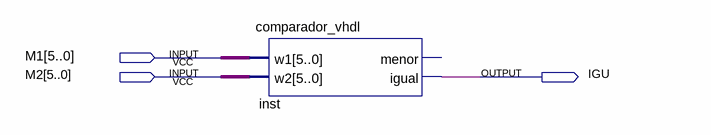
[diagram p0: schematic sheet]
// Quartus schematic PRUEBAS.bdf as structural Verilog: 1 symbols, 3 pins
module PRUEBAS (
  input  [5:0] M1,
  input  [5:0] M2,
  output IGU
);

  comparador_vhdl inst (.w1(M1), .w2(M2), .igual(IGU));  // open: menor
endmodule
